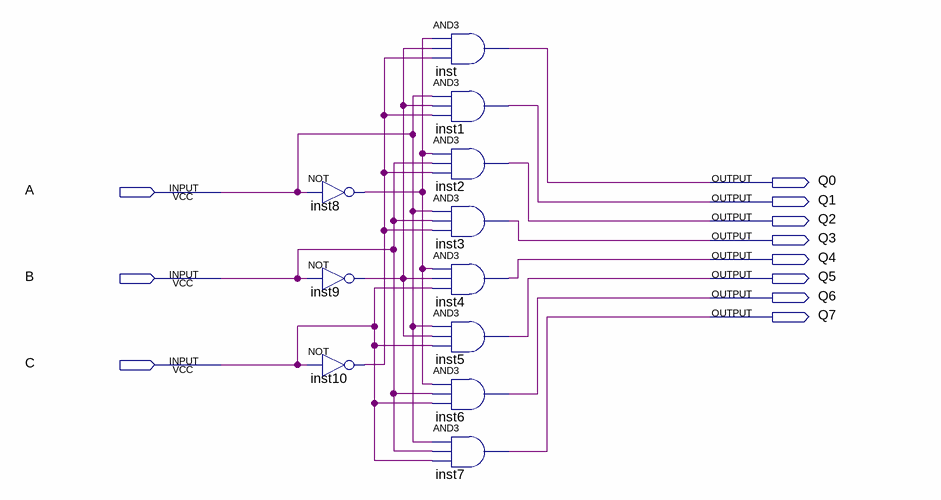
[diagram p0: schematic sheet]
// Quartus schematic 3_8decoder.bdf as structural Verilog: 11 symbols, 11 pins
module \3_8decoder  (
  input  A,
  input  B,
  input  C,
  output Q0,
  output Q1,
  output Q2,
  output Q3,
  output Q4,
  output Q5,
  output Q6,
  output Q7
);

  wire inst8_out, inst9_out, inst10_out;

  not inst8 (inst8_out, A);
  not inst9 (inst9_out, B);
  not inst10 (inst10_out, C);
  and inst (Q0, inst8_out, inst9_out, inst10_out);
  and inst1 (Q1, A, inst9_out, inst10_out);
  and inst2 (Q2, inst8_out, B, inst10_out);
  and inst3 (Q3, A, B, inst10_out);
  and inst4 (Q4, inst8_out, inst9_out, C);
  and inst5 (Q5, A, inst9_out, C);
  and inst6 (Q6, inst8_out, B, C);
  and inst7 (Q7, A, B, C);
endmodule
